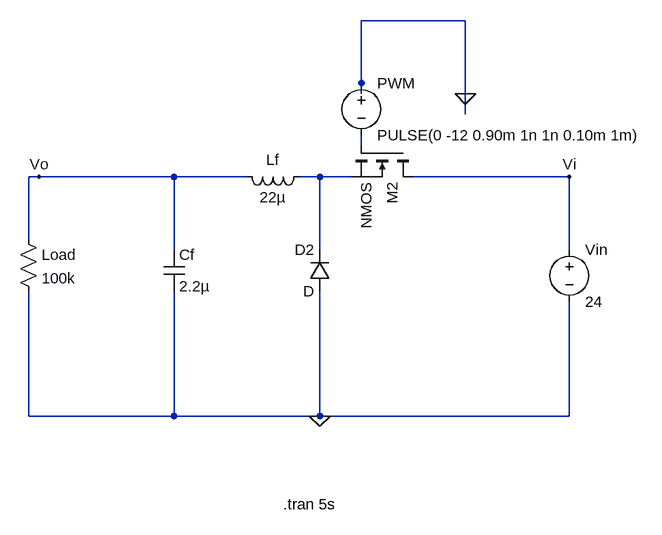
[diagram p0: schematic ENCORE GROUP 44 .asc]
ENCORE GROUP 44 .asc, the LTspice schematic file:
Version 4
SHEET 1 2188 680
WIRE 1648 -320 1488 -320
WIRE 1488 -224 1488 -320
WIRE 1488 -208 1488 -224
WIRE 1648 -208 1648 -320
WIRE 1648 -176 1648 -208
WIRE 1488 -128 1488 -144
WIRE 992 -80 976 -80
WIRE 1200 -80 992 -80
WIRE 1312 -80 1200 -80
WIRE 1424 -80 1392 -80
WIRE 1472 -80 1424 -80
WIRE 1808 -80 1568 -80
WIRE 976 16 976 -80
WIRE 1200 32 1200 -80
WIRE 1424 32 1424 -80
WIRE 1808 32 1808 -80
WIRE 976 288 976 96
WIRE 1200 288 1200 96
WIRE 1200 288 976 288
WIRE 1424 288 1424 96
WIRE 1424 288 1200 288
WIRE 1808 288 1808 112
WIRE 1808 288 1424 288
FLAG 1424 288 0
FLAG 1648 -208 0
FLAG 992 -80 Vo
FLAG 1808 -80 Vi
SYMBOL nmos 1568 -128 R90
SYMATTR InstName M2
SYMBOL ind 1408 -96 R90
WINDOW 0 5 56 VBottom 2
WINDOW 3 32 56 VTop 2
SYMATTR InstName Lf
SYMATTR Value 22µ
SYMBOL cap 1184 32 R0
SYMATTR InstName Cf
SYMATTR Value 2.2µ
SYMBOL res 960 0 R0
SYMATTR InstName Load
SYMATTR Value 100k
SYMBOL voltage 1808 16 R0
SYMATTR InstName Vin
SYMATTR Value 24
SYMBOL diode 1440 96 R180
WINDOW 0 24 64 Left 2
WINDOW 3 24 0 Left 2
SYMATTR InstName D2
SYMBOL voltage 1488 -240 R0
SYMATTR InstName PWM
SYMATTR Value PULSE(0 -12 0.90m 1n 1n 0.10m 1m)
TEXT 1368 424 Left 2 !.tran 5s

The netlist it stands for:
* ENCORE GROUP 44 .asc
M2 Vi N001 N002 N002 NMOS
Lf N002 Vo 22µ
Cf Vo 0 2.2µ
R§Load Vo 0 100k
Vin Vi 0 24
D2 0 N002 D
V§PWM 0 N001 PULSE(0 -12 0.90m 1n 1n 0.10m 1m)
.model D D
.lib standard.dio
.model NMOS NMOS
.model PMOS PMOS
.lib standard.mos
.tran 5s
.backanno
.end